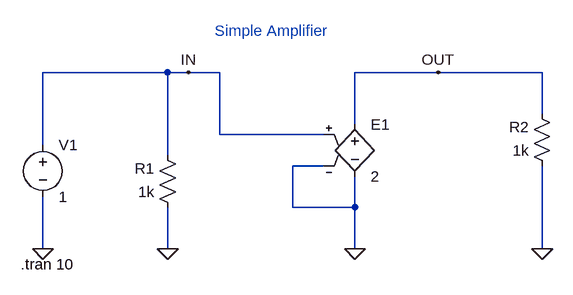
[diagram p0: schematic VoltageDependentVoltageSouce.asc]
VoltageDependentVoltageSouce.asc, the LTspice schematic file:
Version 4
SHEET 1 880 680
WIRE -80 32 -272 32
WIRE -48 32 -80 32
WIRE 0 32 -48 32
WIRE 336 32 208 32
WIRE 496 32 336 32
WIRE 496 96 496 32
WIRE 208 112 208 32
WIRE 0 128 0 32
WIRE 160 128 0 128
WIRE -272 144 -272 32
WIRE -80 160 -80 32
WIRE 160 176 112 176
WIRE 112 240 112 176
WIRE 208 240 208 192
WIRE 208 240 112 240
WIRE -272 304 -272 224
WIRE -80 304 -80 240
WIRE 208 304 208 240
WIRE 496 304 496 176
FLAG 208 304 0
FLAG 496 304 0
FLAG -80 304 0
FLAG -272 304 0
FLAG 336 32 OUT
FLAG -48 32 IN
SYMBOL e 208 96 R0
SYMATTR InstName E1
SYMATTR Value 2
SYMBOL res -64 256 R180
WINDOW 0 36 76 Left 2
WINDOW 3 36 40 Left 2
SYMATTR InstName R1
SYMATTR Value 1k
SYMBOL res 512 192 R180
WINDOW 0 36 76 Left 2
WINDOW 3 36 40 Left 2
SYMATTR InstName R2
SYMATTR Value 1k
SYMBOL voltage -272 128 R0
SYMATTR InstName V1
SYMATTR Value 1
TEXT -306 328 Left 2 !.tran 10
TEXT -8 -32 Left 2 ;Simple Amplifier

The netlist it stands for:
* VoltageDependentVoltageSouce.asc
E1 OUT 0 IN 0 2
R1 0 IN 1k
R2 0 OUT 1k
V1 IN 0 1
.tran 10
* Simple Amplifier
.backanno
.end